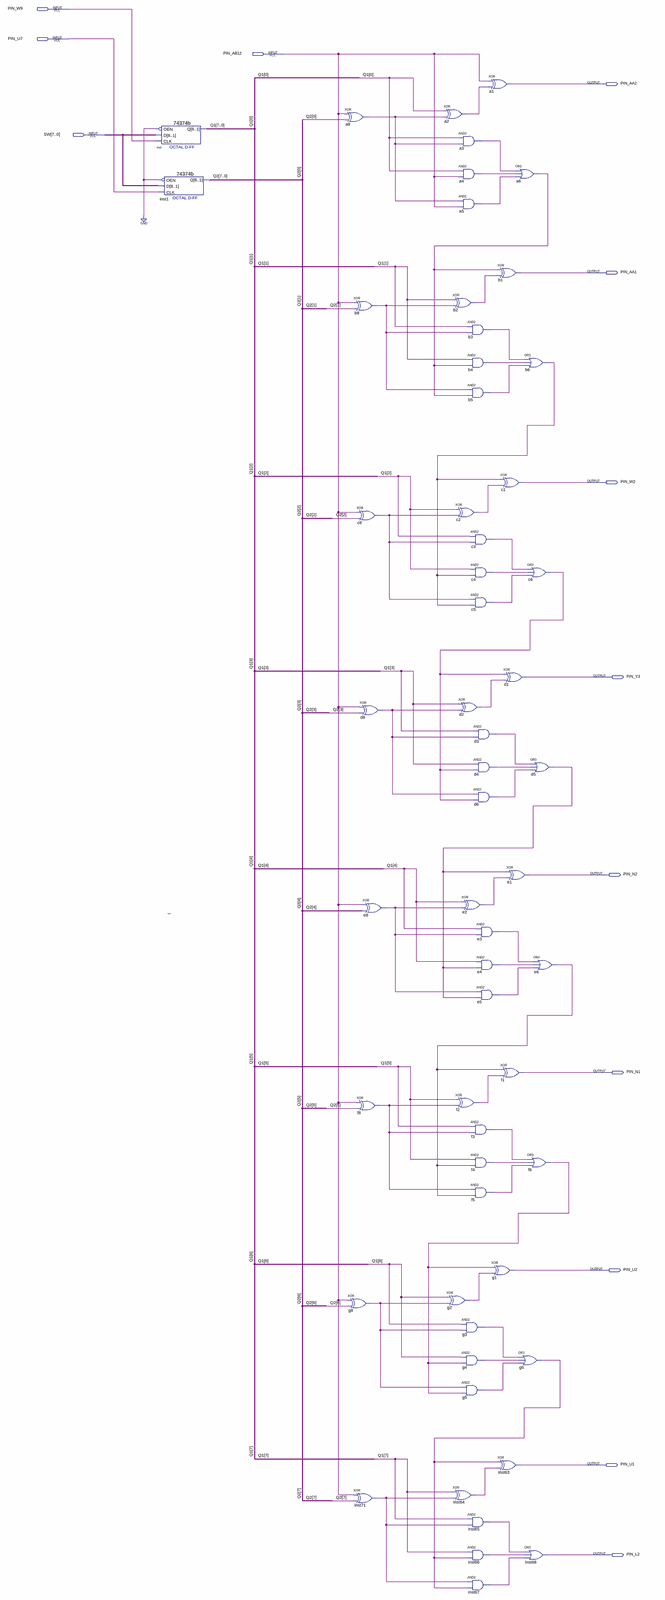
[diagram p0: schematic sheet, whole]
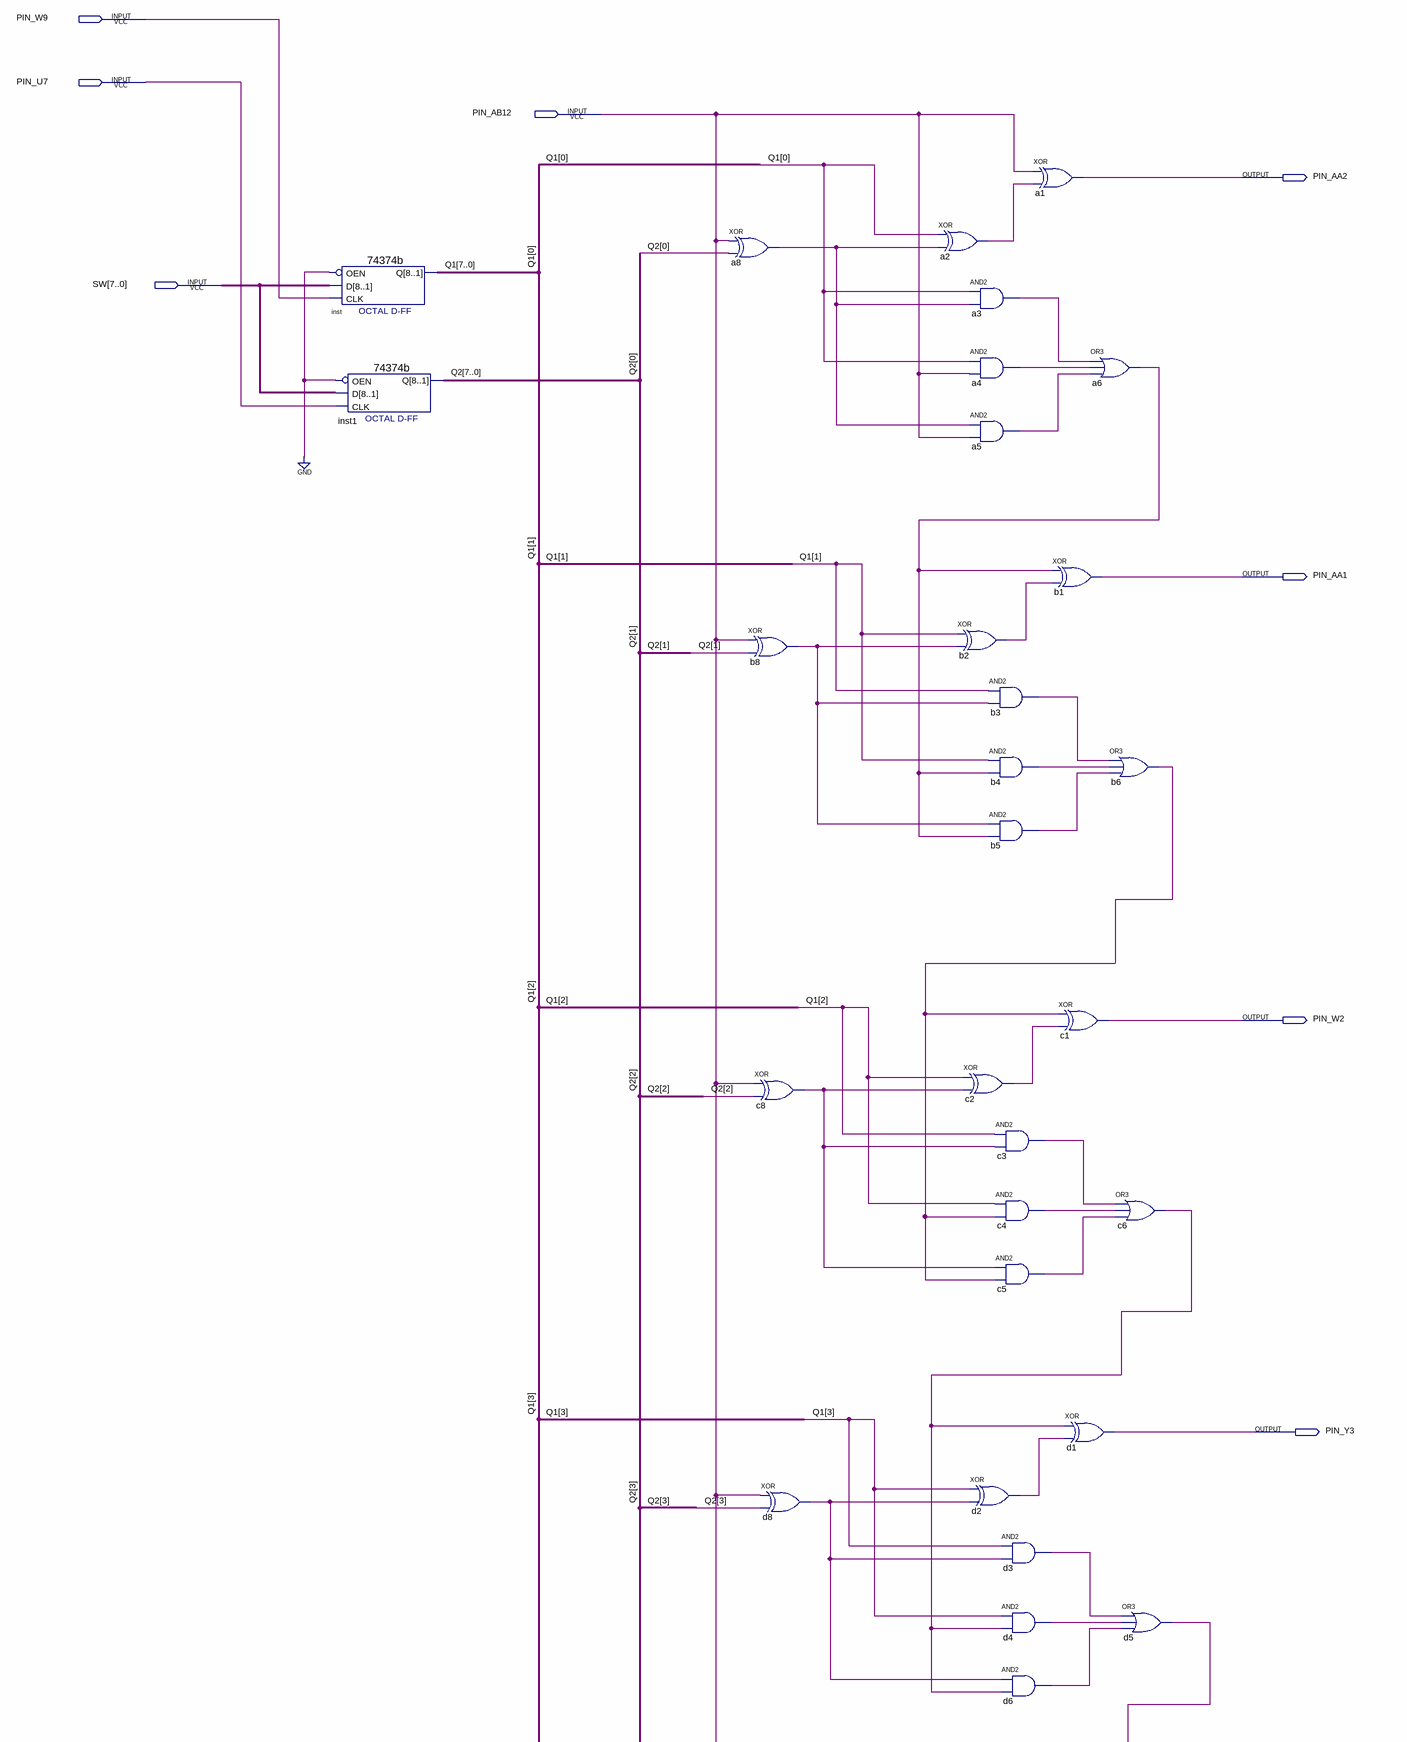
[diagram p1: schematic sheet, upper part]
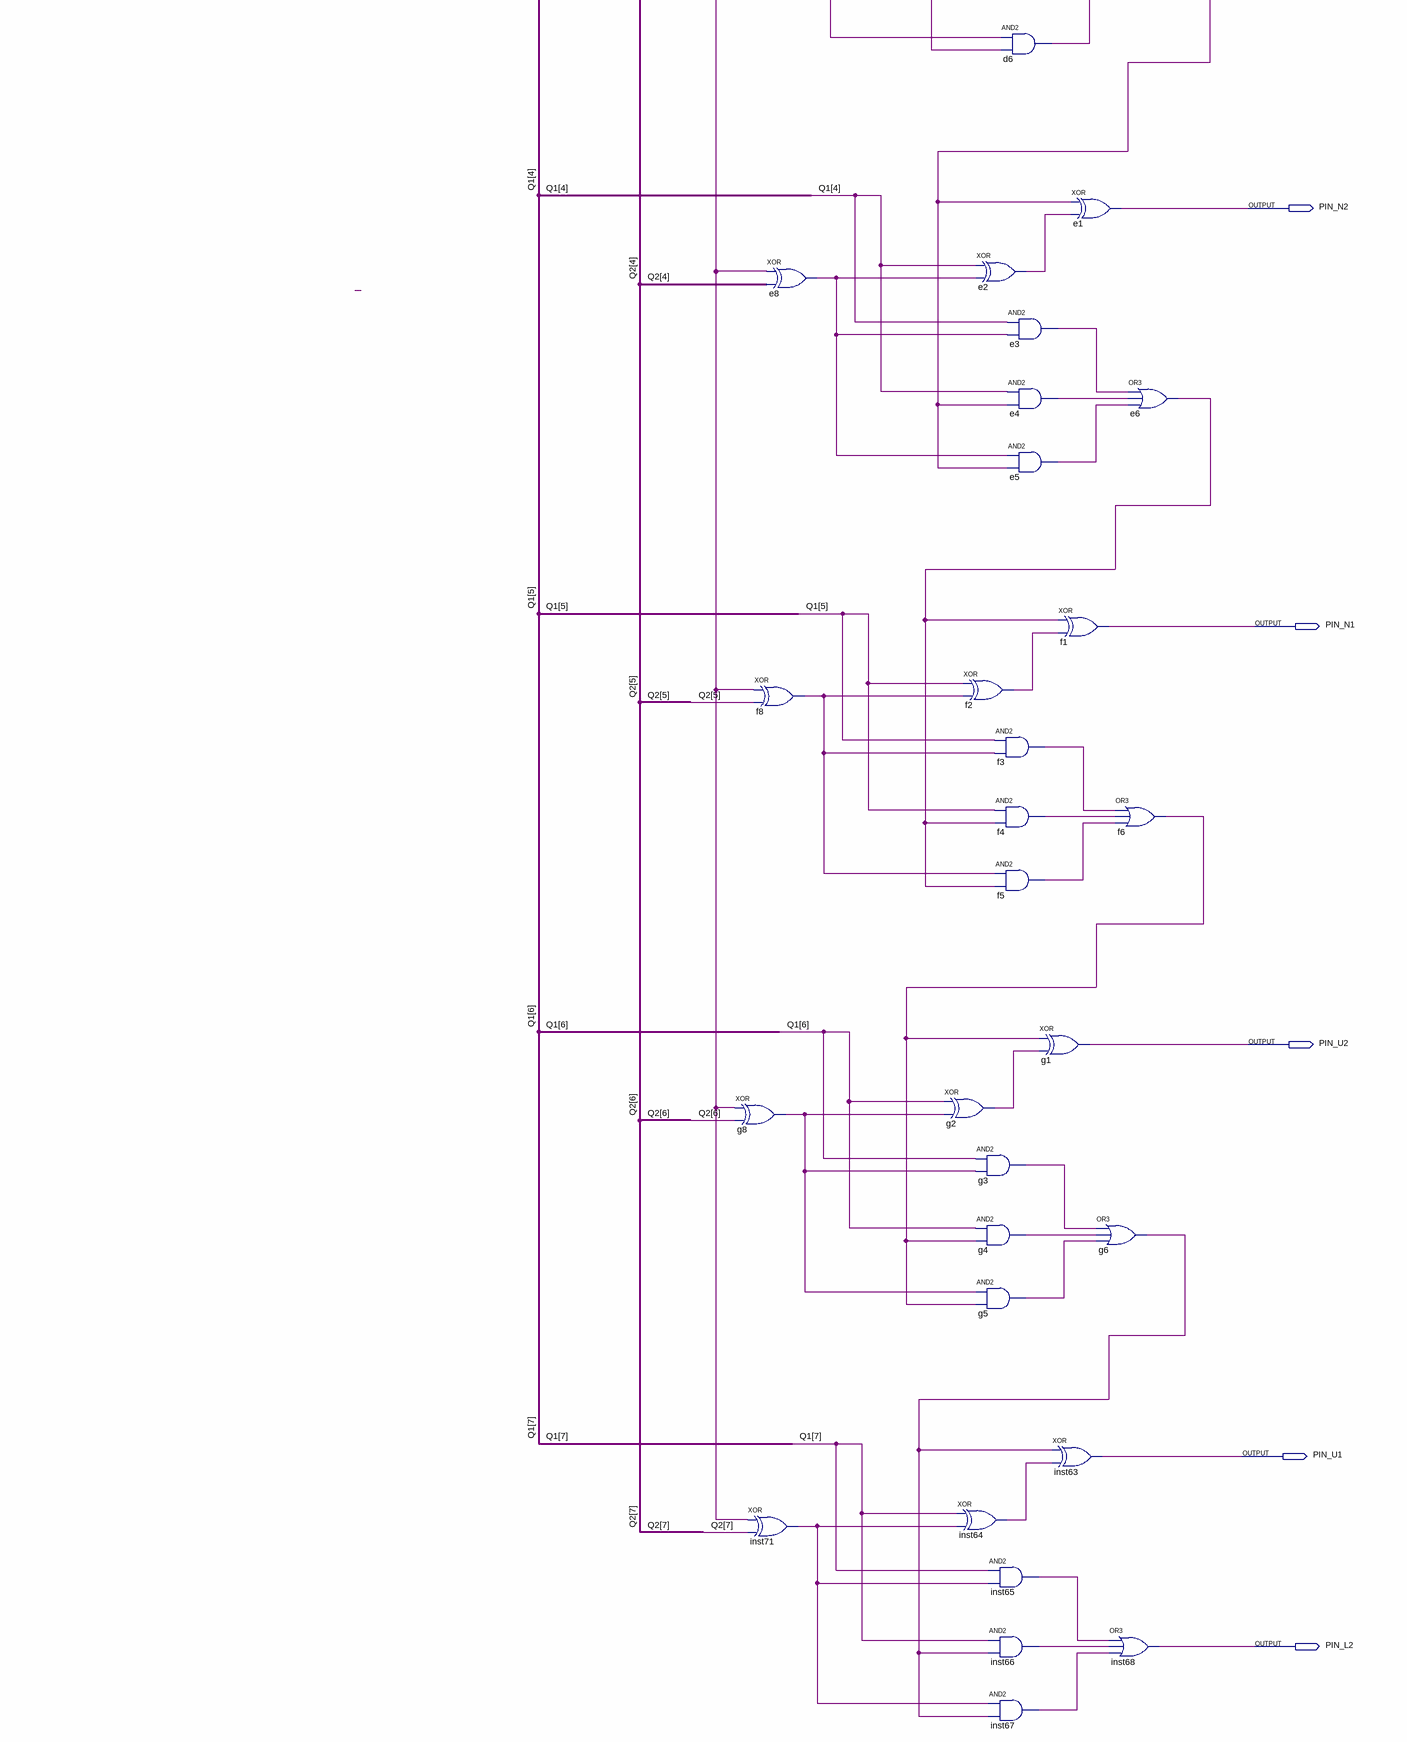
[diagram p2: schematic sheet, lower part]
// Quartus schematic 8-BitAdder.bdf as structural Verilog: 58 symbols, 13 pins
module \8-BitAdder  (
  input  PIN_W9,
  input  PIN_U7,
  input  PIN_AB12,
  input  [7:0] SW,
  output PIN_AA2,
  output PIN_AA1,
  output PIN_W2,
  output PIN_Y3,
  output PIN_N2,
  output PIN_N1,
  output PIN_U2,
  output PIN_U1,
  output PIN_L2
);

  wire a2_out, a3_out, a4_out, a5_out, a6_out, a8_out, b2_out, b3_out, b4_out, b5_out, b6_out, b8_out,
       c2_out, c3_out, c4_out, c5_out, c6_out, c8_out, d2_out, d3_out, d4_out, d5_out, d6_out, d8_out,
       e2_out, e3_out, e4_out, e5_out, e6_out, e8_out, f2_out, f3_out, f4_out, f5_out, f6_out, f8_out,
       g2_out, g3_out, g4_out, g5_out, g6_out, g8_out, inst64_out, inst65_out, inst66_out, inst67_out,
       inst71_out;
  wire [7:0] Q1, Q2;

  \74374b  inst (.D(SW), .OEN(1'b0), .CLK(PIN_W9), .Q(Q1));
  \74374b  inst1 (.D(SW), .OEN(1'b0), .CLK(PIN_U7), .Q(Q2));
  xor a8 (a8_out, PIN_AB12, Q2[0]);
  xor g8 (g8_out, PIN_AB12, Q2[6]);
  xor b8 (b8_out, PIN_AB12, Q2[1]);
  xor c8 (c8_out, PIN_AB12, Q2[2]);
  xor d8 (d8_out, PIN_AB12, Q2[3]);
  xor e8 (e8_out, PIN_AB12, Q2[4]);
  xor f8 (f8_out, PIN_AB12, Q2[5]);
  xor inst71 (inst71_out, PIN_AB12, Q2[7]);
  xor a2 (a2_out, Q1[0], a8_out);
  and a3 (a3_out, Q1[0], a8_out);
  and a4 (a4_out, Q1[0], PIN_AB12);
  and a5 (a5_out, a8_out, PIN_AB12);
  xor b2 (b2_out, Q1[1], b8_out);
  and b3 (b3_out, Q1[1], b8_out);
  and b4 (b4_out, Q1[1], a6_out);
  and b5 (b5_out, b8_out, a6_out);
  xor c2 (c2_out, Q1[2], c8_out);
  xor d2 (d2_out, Q1[3], d8_out);
  xor e2 (e2_out, Q1[4], e8_out);
  xor f2 (f2_out, Q1[5], f8_out);
  xor g2 (g2_out, Q1[6], g8_out);
  and g3 (g3_out, Q1[6], g8_out);
  and g4 (g4_out, Q1[6], f6_out);
  and g5 (g5_out, g8_out, f6_out);
  xor inst64 (inst64_out, Q1[7], inst71_out);
  and inst65 (inst65_out, Q1[7], inst71_out);
  and inst66 (inst66_out, Q1[7], g6_out);
  and inst67 (inst67_out, inst71_out, g6_out);
  xor a1 (PIN_AA2, PIN_AB12, a2_out);
  and c3 (c3_out, Q1[2], c8_out);
  and c4 (c4_out, Q1[2], b6_out);
  and c5 (c5_out, c8_out, b6_out);
  and d3 (d3_out, Q1[3], d8_out);
  and d4 (d4_out, Q1[3], c6_out);
  and d6 (d6_out, d8_out, c6_out);
  and e3 (e3_out, Q1[4], e8_out);
  and e4 (e4_out, Q1[4], d5_out);
  and e5 (e5_out, e8_out, d5_out);
  and f3 (f3_out, Q1[5], f8_out);
  and f4 (f4_out, Q1[5], e6_out);
  and f5 (f5_out, f8_out, e6_out);
  xor g1 (PIN_U2, f6_out, g2_out);
  or a6 (a6_out, a3_out, a4_out, a5_out);
  xor b1 (PIN_AA1, a6_out, b2_out);
  xor c1 (PIN_W2, b6_out, c2_out);
  xor d1 (PIN_Y3, c6_out, d2_out);
  xor e1 (PIN_N2, d5_out, e2_out);
  xor f1 (PIN_N1, e6_out, f2_out);
  xor inst63 (PIN_U1, g6_out, inst64_out);
  or b6 (b6_out, b3_out, b4_out, b5_out);
  or c6 (c6_out, c3_out, c4_out, c5_out);
  or d5 (d5_out, d3_out, d4_out, d6_out);
  or e6 (e6_out, e3_out, e4_out, e5_out);
  or f6 (f6_out, f3_out, f4_out, f5_out);
  or g6 (g6_out, g3_out, g4_out, g5_out);
  or inst68 (PIN_L2, inst65_out, inst66_out, inst67_out);
endmodule
